# EasyEDA schematic SCH_Xmas-tree_2025-12-16.json

## Sheets
1 Sheet_2: TITLE: Sheet_2; REV: 1.0; Date: 2022-12-02; Sheet: 1/1; Drawn By: Bibulle Martin; Company: Your Company
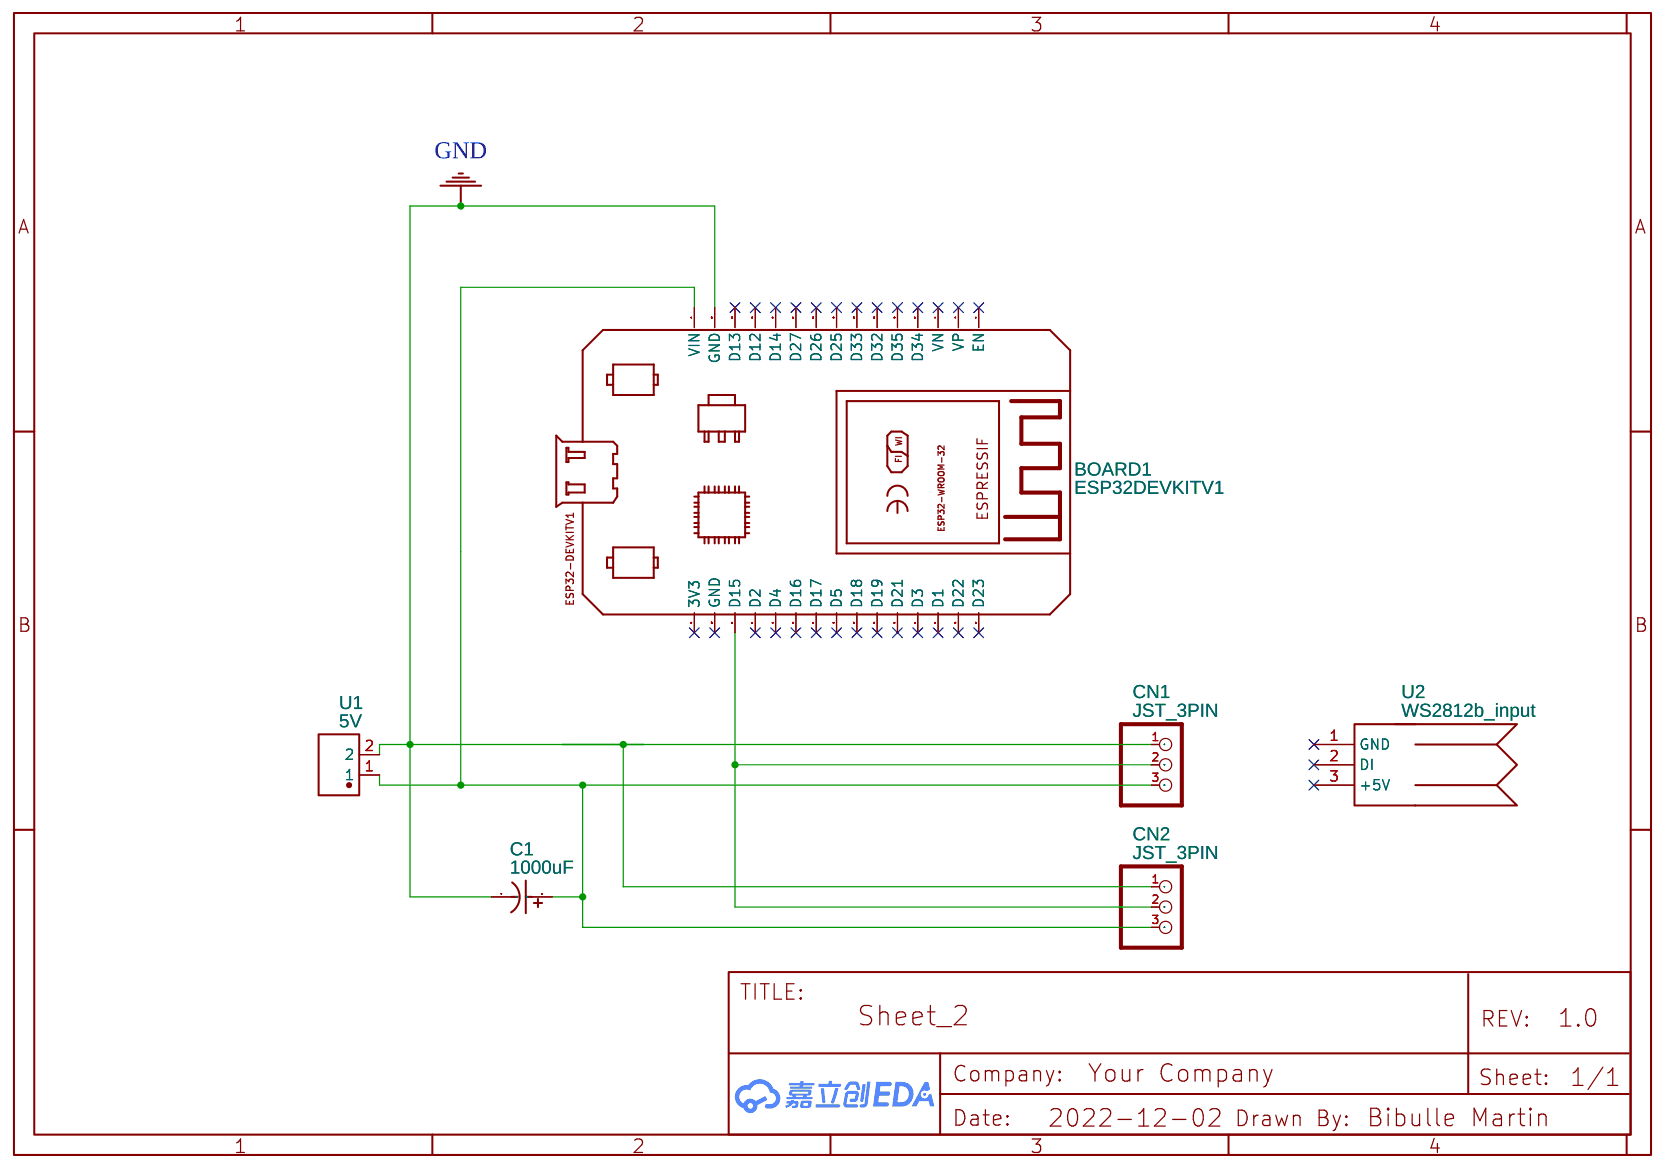
[diagram p0: Sheet_2]
2 Sheet_3_ESP32-S3: TITLE: Sheet_3 ESP32-S3
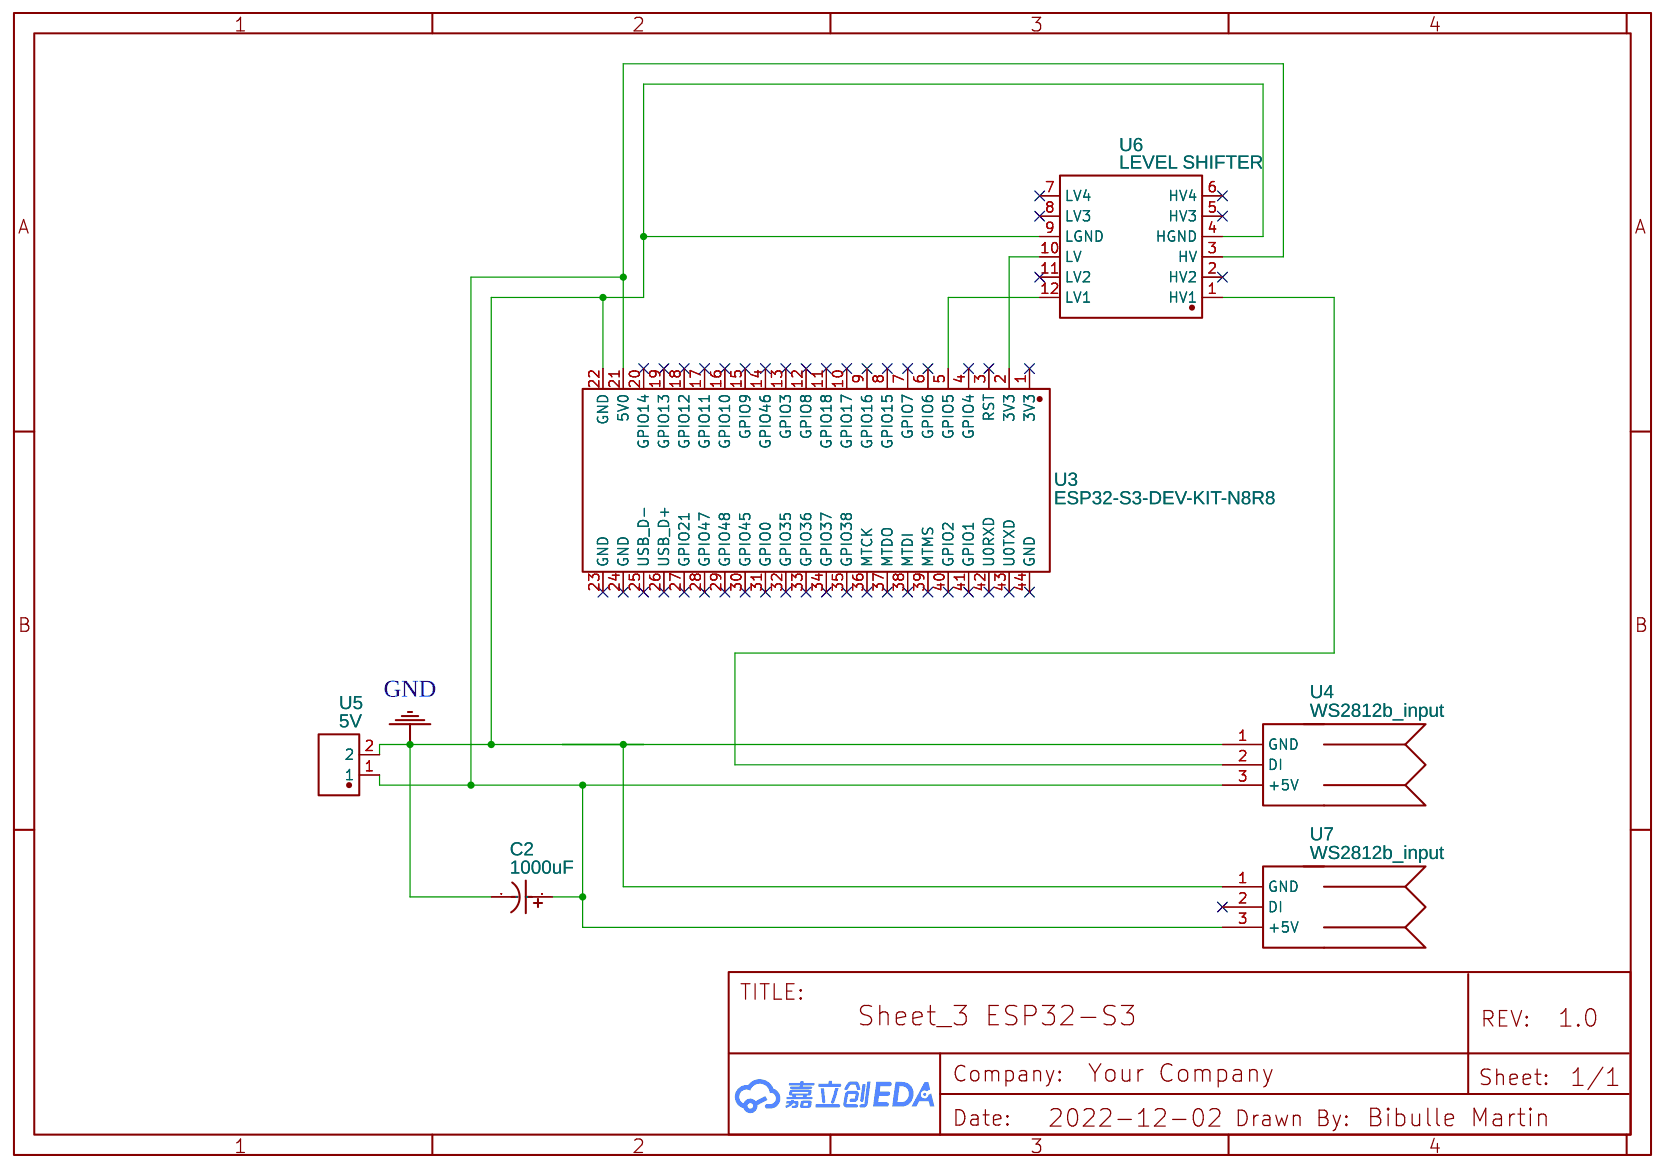
[diagram p1: Sheet_3_ESP32-S3]

## Parts
sheet Sheet_2
BOARD1  ESP32DEVKITV1  [ESP32-DEVKITV1]
C1  1000uF  [CAP-TH_BD8.0-P3.50-D0.5-FD]
CN1  JST_3PIN  [JSTPH3]
CN2  JST_3PIN  [JSTPH3]
U1  5V  [CONN-TH_2P-P5.08_L8.5-W10.2]
U2  WS2812b_input  [WS2812B_INPUT]
sheet Sheet_3_ESP32-S3
C2  1000uF  [CAP-TH_BD8.0-P3.50-D0.5-FD]
U3  ESP32-S3-DEV-KIT-N8R8  [COMM-TH_L63.3-W25.4-P2.54-LS22.86]
U4  WS2812b_input  [WS2812B_INPUT]
U5  5V  [CONN-TH_2P-P5.08_L8.5-W10.2]
U6  LEVEL SHIFTER  [CYT1076]
U7  WS2812b_input  [WS2812B_INPUT]

## Library data of the parts
BOARD1 = ESP32DEVKITV1: Contributor: Sumeet Kumar
C1 C2 = 1000uF 16V 8*16: Supplier: LCSC; Manufacturer: CX(承兴); Manufacturer Part: KM108M016F16RR0VH2FP0; Supplier Part: C43832; JLCPCB Part Class: Extended Part; link: https://lcsc.com/eda_search?q=C43832&%26type=1&ref=editor
CN1 CN2 = JST_3PIN: Contributor: Adafruit
U1 U5 = DB127V-5.0-2P: Supplier: LCSC; Supplier Part: C395885; Manufacturer: DIBO(地博电气); Manufacturer Part: DB127V-5.0-2P-GN-S; Contributor: LCSC; JLCPCB Part Class: Extended Part
U2 U4 U7 = WS2812b_input: Contributor: Bibulle Martin
U3 = ESP32-S3-DEV-KIT-N8R8: Supplier: LCSC; Supplier Part: C9900170771; Manufacturer: null; Contributor: lcsc
U6 = ARTGEAR LEVEL SHIFTER: Contributor: Jason Vasquez

## Nets
GND: BOARD1.GND C1.2 C2.2 CN1.1 CN2.1 U1.2 U3.22(GND) U4.1(GND) U5.2 U6.4(HGND) U6.9(LGND) U7.1(GND)
Net-(BOARD1-D15): BOARD1.D15 CN1.2 CN2.2
Net-(BOARD1-VIN): BOARD1.VIN C1.1 CN1.3 CN2.3 U1.1
Net-(C2-1): C2.1 U3.21(5V0) U4.3(+5V) U5.1 U6.3(HV) U7.3(+5V)
Net-(U3-2): U3.2(3V3) U6.10(LV)
Net-(U3-5): U3.5(GPIO5) U6.12(LV1)
Net-(U4-2): U4.2(DI) U6.1(HV1)

Not connected (* = marked no-connect by the designer): BOARD1 3V3* D1* D2* D3* D4* D5* D12* D13* D14* D16* D17* D18* D19* D21* D22* D23* D25* D26* D27* D32* D33* D34* D35* EN* GND@1(GND)* VN* VP*; U2 1(GND)* 2(DI)* 3(+5V)*; U3 1(3V3)* 3(RST)* 4(GPIO4)* 6(GPIO6)* 7(GPIO7)* 8(GPIO15)* 9(GPIO16)* 10(GPIO17)* 11(GPIO18)* 12(GPIO8)* 13(GPIO3)* 14(GPIO46)* 15(GPIO9)* 16(GPIO10)* 17(GPIO11)* 18(GPIO12)* 19(GPIO13)* 20(GPIO14)* 23(GND)* 24(GND)* 25(USB_D-)* 26(USB_D+)* 27(GPIO21)* 28(GPIO47)* 29(GPIO48)* 30(GPIO45)* 31(GPIO0)* 32(GPIO35)* 33(GPIO36)* 34(GPIO37)* 35(GPIO38)* 36(MTCK)* 37(MTDO)* 38(MTDI)* 39(MTMS)* 40(GPIO2)* 41(GPIO1)* 42(U0RXD)* 43(U0TXD)* 44(GND)*; U6 2(HV2)* 5(HV3)* 6(HV4)* 7(LV4)* 8(LV3)* 11(LV2)*; U7 2(DI)*
